# Altium schematic sheet 03_Power_Amp.SchDoc
size A4; SheetNumber: 3; SheetTotal: 4
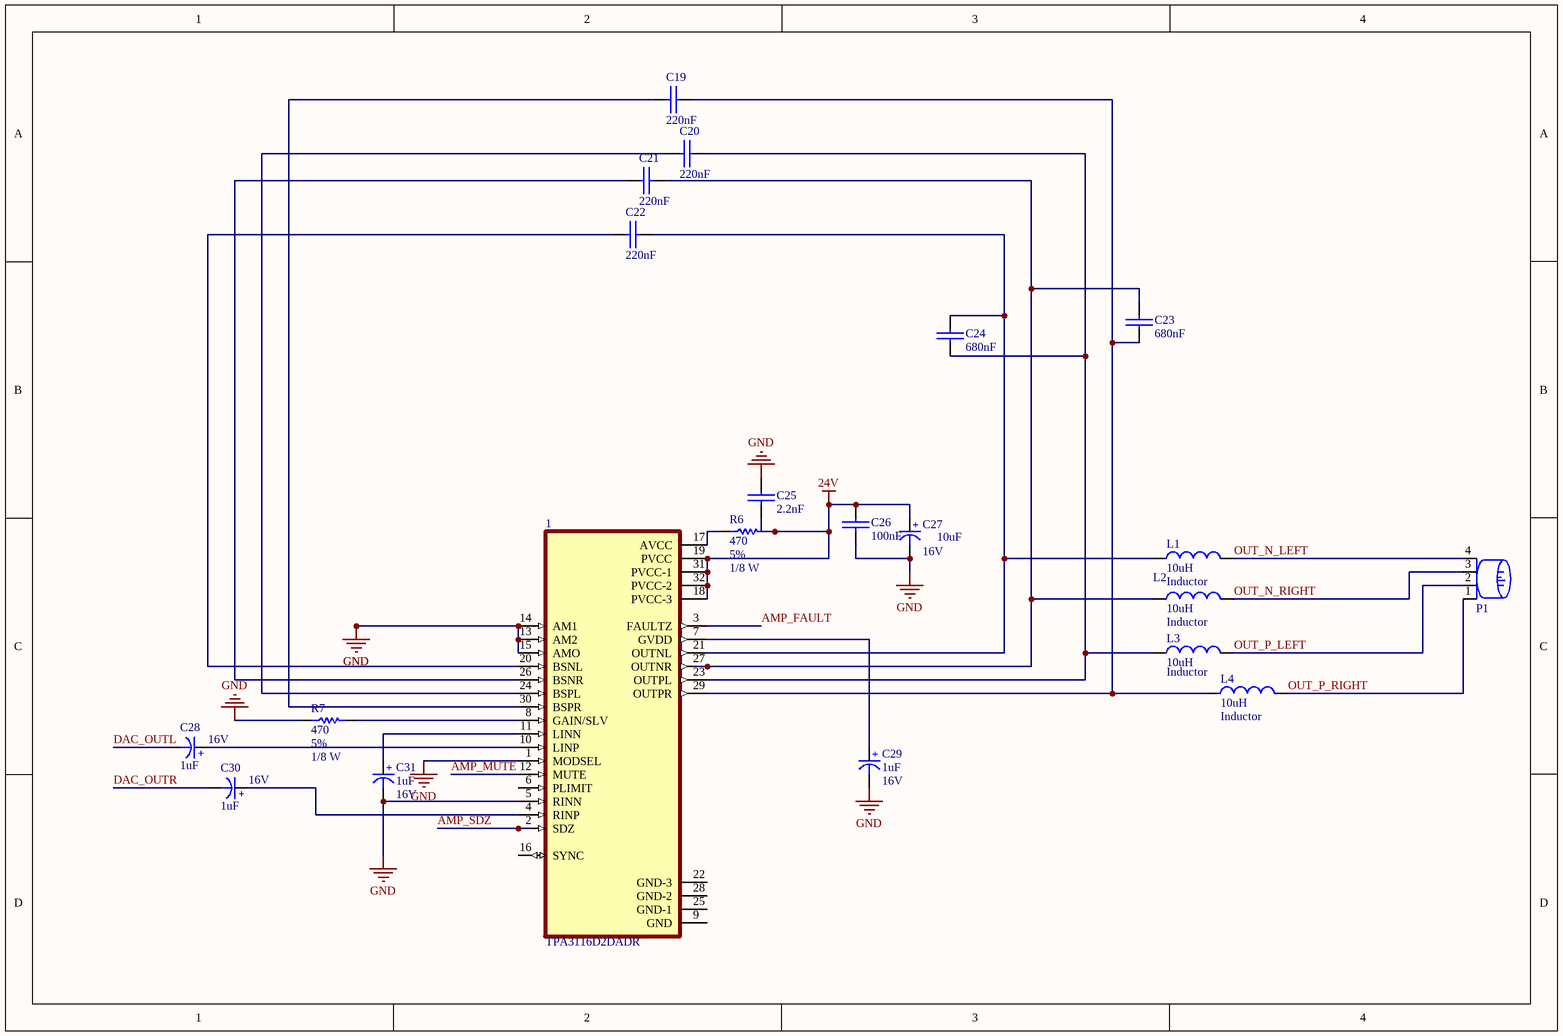
[diagram p0: 03_Power_Amp.SchDoc]

## Parts
1  TPA3116D2DADR  [SOP65P810X115-33N]
C19  220nF  [SMD_CAP_1206]
C20  220nF  [SMD_CAP_1206]
C21  220nF  [SMD_CAP_1206]
C22  220nF  [SMD_CAP_1206]
C23  680nF  [SMD_CAP_1206]
C24  680nF  [SMD_CAP_1206]
C25  2.2nF  [SMD_CAP_1206]
C26  100nF  [SMD_CAP_1206]
C27  Voltage: 16V  [cap 01]  (hidden comment: 10uF)
C28  Voltage: 16V  [cap 01]  (hidden comment: 1uF)
C29  Voltage: 16V  [cap 01]  (hidden comment: 1uF)
C30  Voltage: 16V  [cap 01]  (hidden comment: 1uF)
C31  Voltage: 16V  [cap 01]  (hidden comment: 1uF)
L1  Inductor  value 10uH  [INDC1608L]
L2  Inductor  value 10uH  [INDC1608L]
L3  Inductor  value 10uH  [INDC1608L]
L4  Inductor  value 10uH  [INDC1608L]
P1  Socket 4 Pin  [4pin]  (value not drawn)
R6  Tolerance: 5%  Power: 1/8 W  [RES 0805 (2012X06L)]  (hidden comment: 470)
R7  Tolerance: 5%  Power: 1/8 W  [RES 0805 (2012X06L)]  (hidden comment: 470)

## Nets
24V: 1.18(PVCC-3) 1.19(PVCC) 1.31(PVCC-1) 1.32(PVCC-2) C25.2(-) C26.2(-) C27.1(+) R6.2
GND: 1.1(MODSEL) 1.5(RINN) 1.13(AM2) 1.14(AM1) 1.15(AMO) C25.1(+) C26.1(+) C27.2(-) C29.2(-) C31.2(-) R7.1
AMP_FAULT: 1.3(FAULTZ)
AMP_MUTE: 1.12(MUTE)
AMP_SDZ: 1.2(SDZ)
DAC_OUTL: C28.2(-)
DAC_OUTR: C30.2(-)
OUT_N_LEFT: L1.2 P1.4
OUT_N_RIGHT: L2.2 P1.3
OUT_P_LEFT: L3.2 P1.2
OUT_P_RIGHT: L4.2 P1.1
Net1_4: 1.4(RINP) C30.1(+)
Net1_7: 1.7(GVDD) C29.1(+)
Net1_8: 1.8(GAIN/SLV) R7.2
Net1_10: 1.10(LINP) C28.1(+)
Net1_11: 1.11(LINN) C31.1(+)
Net1_17: 1.17(AVCC) R6.1
Net1_20: 1.20(BSNL) C22.2(-)
Net1_21: 1.21(OUTNL) C22.1(+) C24.2(-) L1.1
Net1_23: 1.23(OUTPL) C20.1(+) C24.1(+) L3.1
Net1_24: 1.24(BSPL) C20.2(-)
Net1_26: 1.26(BSNR) C21.2(-)
Net1_27: 1.27(OUTNR) C21.1(+) C23.2(-) L2.1
Net1_29: 1.29(OUTPR) C19.1(+) C23.1(+) L4.1
Net1_30: 1.30(BSPR) C19.2(-)

Not connected (* = marked no-connect by the designer): 1 6(PLIMIT) 9(GND) 16(SYNC) 22(GND-3) 25(GND-1) 28(GND-2)

## Library data of the parts
1 = TPA3116D2DADR: 50-W stereo, 100-W mono, 4.5- to 26-V supply, analog input Class-D audio amplifier w/ SpeakerGuardâ„¢; MF: Texas Instruments; SnapEDA_Link: https://www.snapeda.com/parts/TPA3116D2DADR/Texas+Instruments/view-part/?ref=snap; Package: HTSSOP-32 Texas Instruments; Value: *; MP: TPA3116D2DADR; Check_prices: https://www.snapeda.com/parts/TPA3116D2DADR/Texas+Instruments/view-part/?ref=eda
C19-C26 = Cap-Bipolar: Bipolar Capacitor; Voltage: 100V; Designer: Saeid Jorablo; Organazation: ControTec; Adding Date: 1387/12/20
  C19-C22: Value: 220nF
  C23 C24: Value: 680nF
  C25: Value: 2.2nF
  C26: Value: 100nF
C27-C31 = Cap-Polar: Polar Capacitor; Designer: Saeid Jorablo; Organazation: ControTec; Adding Date: 1387/12/20
  C27: Value: 10uF
  C28-C31: Value: 1uF
L1-L4 = Inductor: Code_IEC: 1005; Published: 8-Jun-2000; LatestRevisionDate: 29-May-2009; LatestRevisionNote: IPC-7351 Footprint Added.; PackageReference: 0402-A; Publisher: Altium Limited; PackageDescription: Chip Inductor; Code_JEITA: 0402
P1 = Socket 4 Pin: Power Input
R6 R7 = Resistor: Value: 470